# Altium schematic sheet Cell Phone Module.SchDoc
size A
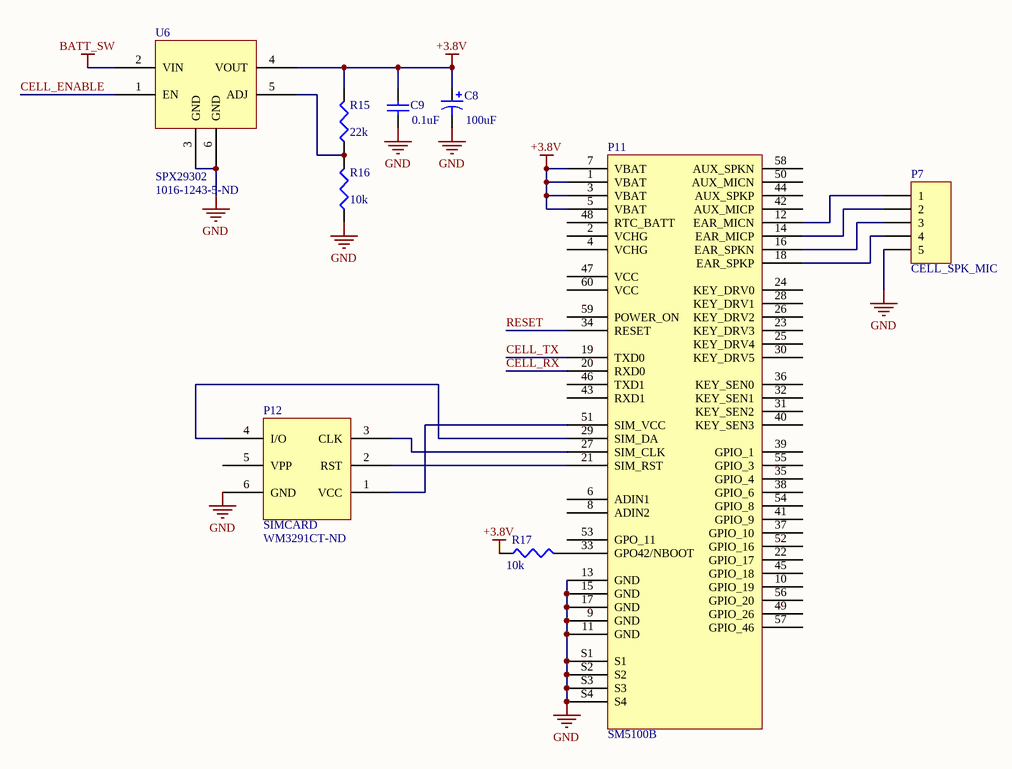
[diagram p0: Cell Phone Module.SchDoc]

## Parts
C8  value 100uF  [TC7343-2917]  (hidden comment: Cap Pol3)
C9  value 0.1uF  [C1206]  (hidden comment: Cap Semi)
P7  CELL_SPK_MIC  [2mm JST PH - 5 pin]
P11  SM5100B  [SM5100B-60PIN]
P12  SIMCARD  Supplier Part Number 1: WM3291CT-ND  [SIMSLOT]
R15  value 22k  [RESC3216M]  (hidden comment: Res3)
R16  value 10k  [RESC3216M]  (hidden comment: Res3)
R17  value 10k  [RESC3216M]  (hidden comment: Res3)
U6  SPX29302  Supplier Part Number 1: 1016-1243-5-ND  [TO170P1520-6N]

## Nets
+3.8V: C8.1 C9.2 P11.1(VBAT) P11.3(VBAT) P11.5(VBAT) P11.7(VBAT) R15.2 R17.1 U6.4(VOUT)
BATT_SW: U6.2(VIN)
GND: C8.2 C9.1 P7.5 P11.9(GND) P11.11(GND) P11.13(GND) P11.15(GND) P11.17(GND) P11.S1 P11.S2 P11.S3 P11.S4 P12.6(GND) R16.1 U6.3(GND) U6.6(GND)
CELL_ENABLE: U6.1(EN)
CELL_RX: P11.20(RXD0)
CELL_TX: P11.19(TXD0)
RESET: P11.34(RESET)
NetP7_1: P7.1 P11.12(EAR_MICN)
NetP7_2: P7.2 P11.14(EAR_MICP)
NetP7_3: P7.3 P11.16(EAR_SPKN)
NetP7_4: P7.4 P11.18(EAR_SPKP)
NetP11_21: P11.21(SIM_RST) P12.2(RST)
NetP11_27: P11.27(SIM_CLK) P12.3(CLK)
NetP11_29: P11.29(SIM_DA) P12.4(I/O)
NetP11_33: P11.33(GPO42/NBOOT) R17.2
NetP11_51: P11.51(SIM_VCC) P12.1(VCC)
NetR15_1: R15.1 R16.2 U6.5(ADJ)

Not connected (* = marked no-connect by the designer): P11 2(VCHG) 4(VCHG) 6(ADIN1) 8(ADIN2) 10(GPIO_19) 22(GPIO_17) 23(KEY_DRV3) 24(KEY_DRV0) 25(KEY_DRV4) 26(KEY_DRV2) 28(KEY_DRV1) 30(KEY_DRV5) 31(KEY_SEN2) 32(KEY_SEN1) 35(GPIO_4) 36(KEY_SEN0) 37(GPIO_10) 38(GPIO_6) 39(GPIO_1) 40(KEY_SEN3) 41(GPIO_9) 42(AUX_MICP) 43(RXD1) 44(AUX_SPKP) 45(GPIO_18) 46(TXD1) 47(VCC) 48(RTC_BATT) 49(GPIO_26) 50(AUX_MICN) 52(GPIO_16) 53(GPO_11) 54(GPIO_8) 55(GPIO_3) 56(GPIO_20) 57(GPIO_46) 58(AUX_SPKN) 59(POWER_ON) 60(VCC); P12 5(VPP)

## Library data of the parts
C8 = Cap Pol3: Polarized Capacitor (Surface Mount); Published: 8-Jun-2000; LatestRevisionDate: 29-May-2009; LatestRevisionNote: IPC-7351 Footprint Added.; PackageReference: C0805; Publisher: Altium Limited; PackageDescription: Chip Capacitor
C9 = Cap Semi: Capacitor (Semiconductor SIM Model); Published: 8-Jun-2000; LatestRevisionDate: 29-May-2009; LatestRevisionNote: IPC-7351 Footprint Added.; PackageReference: C1206; Publisher: Altium Limited; PackageDescription: Chip Capacitor
P7 = Header 5: Header, 5-Pin; LatestRevisionDate: 17-Jul-2002; LatestRevisionNote: Re-released for DXP Platform.; Publisher: Altium Limited
P12 = SIMHOLDER: Supplier 1: Digi-Key
R15-R17 = Res3: Resistor; Published: 8-Jun-2000; LatestRevisionDate: 29-May-2009; LatestRevisionNote: IPC-7351 Footprint Added.; PackageReference: J1-0603; Publisher: Altium Limited; PackageDescription: Chip Resistor
U6 = SPX29302: Supplier 1: Digi-Key